# Altium project Triboelectric NEMS interface.PrjPcb
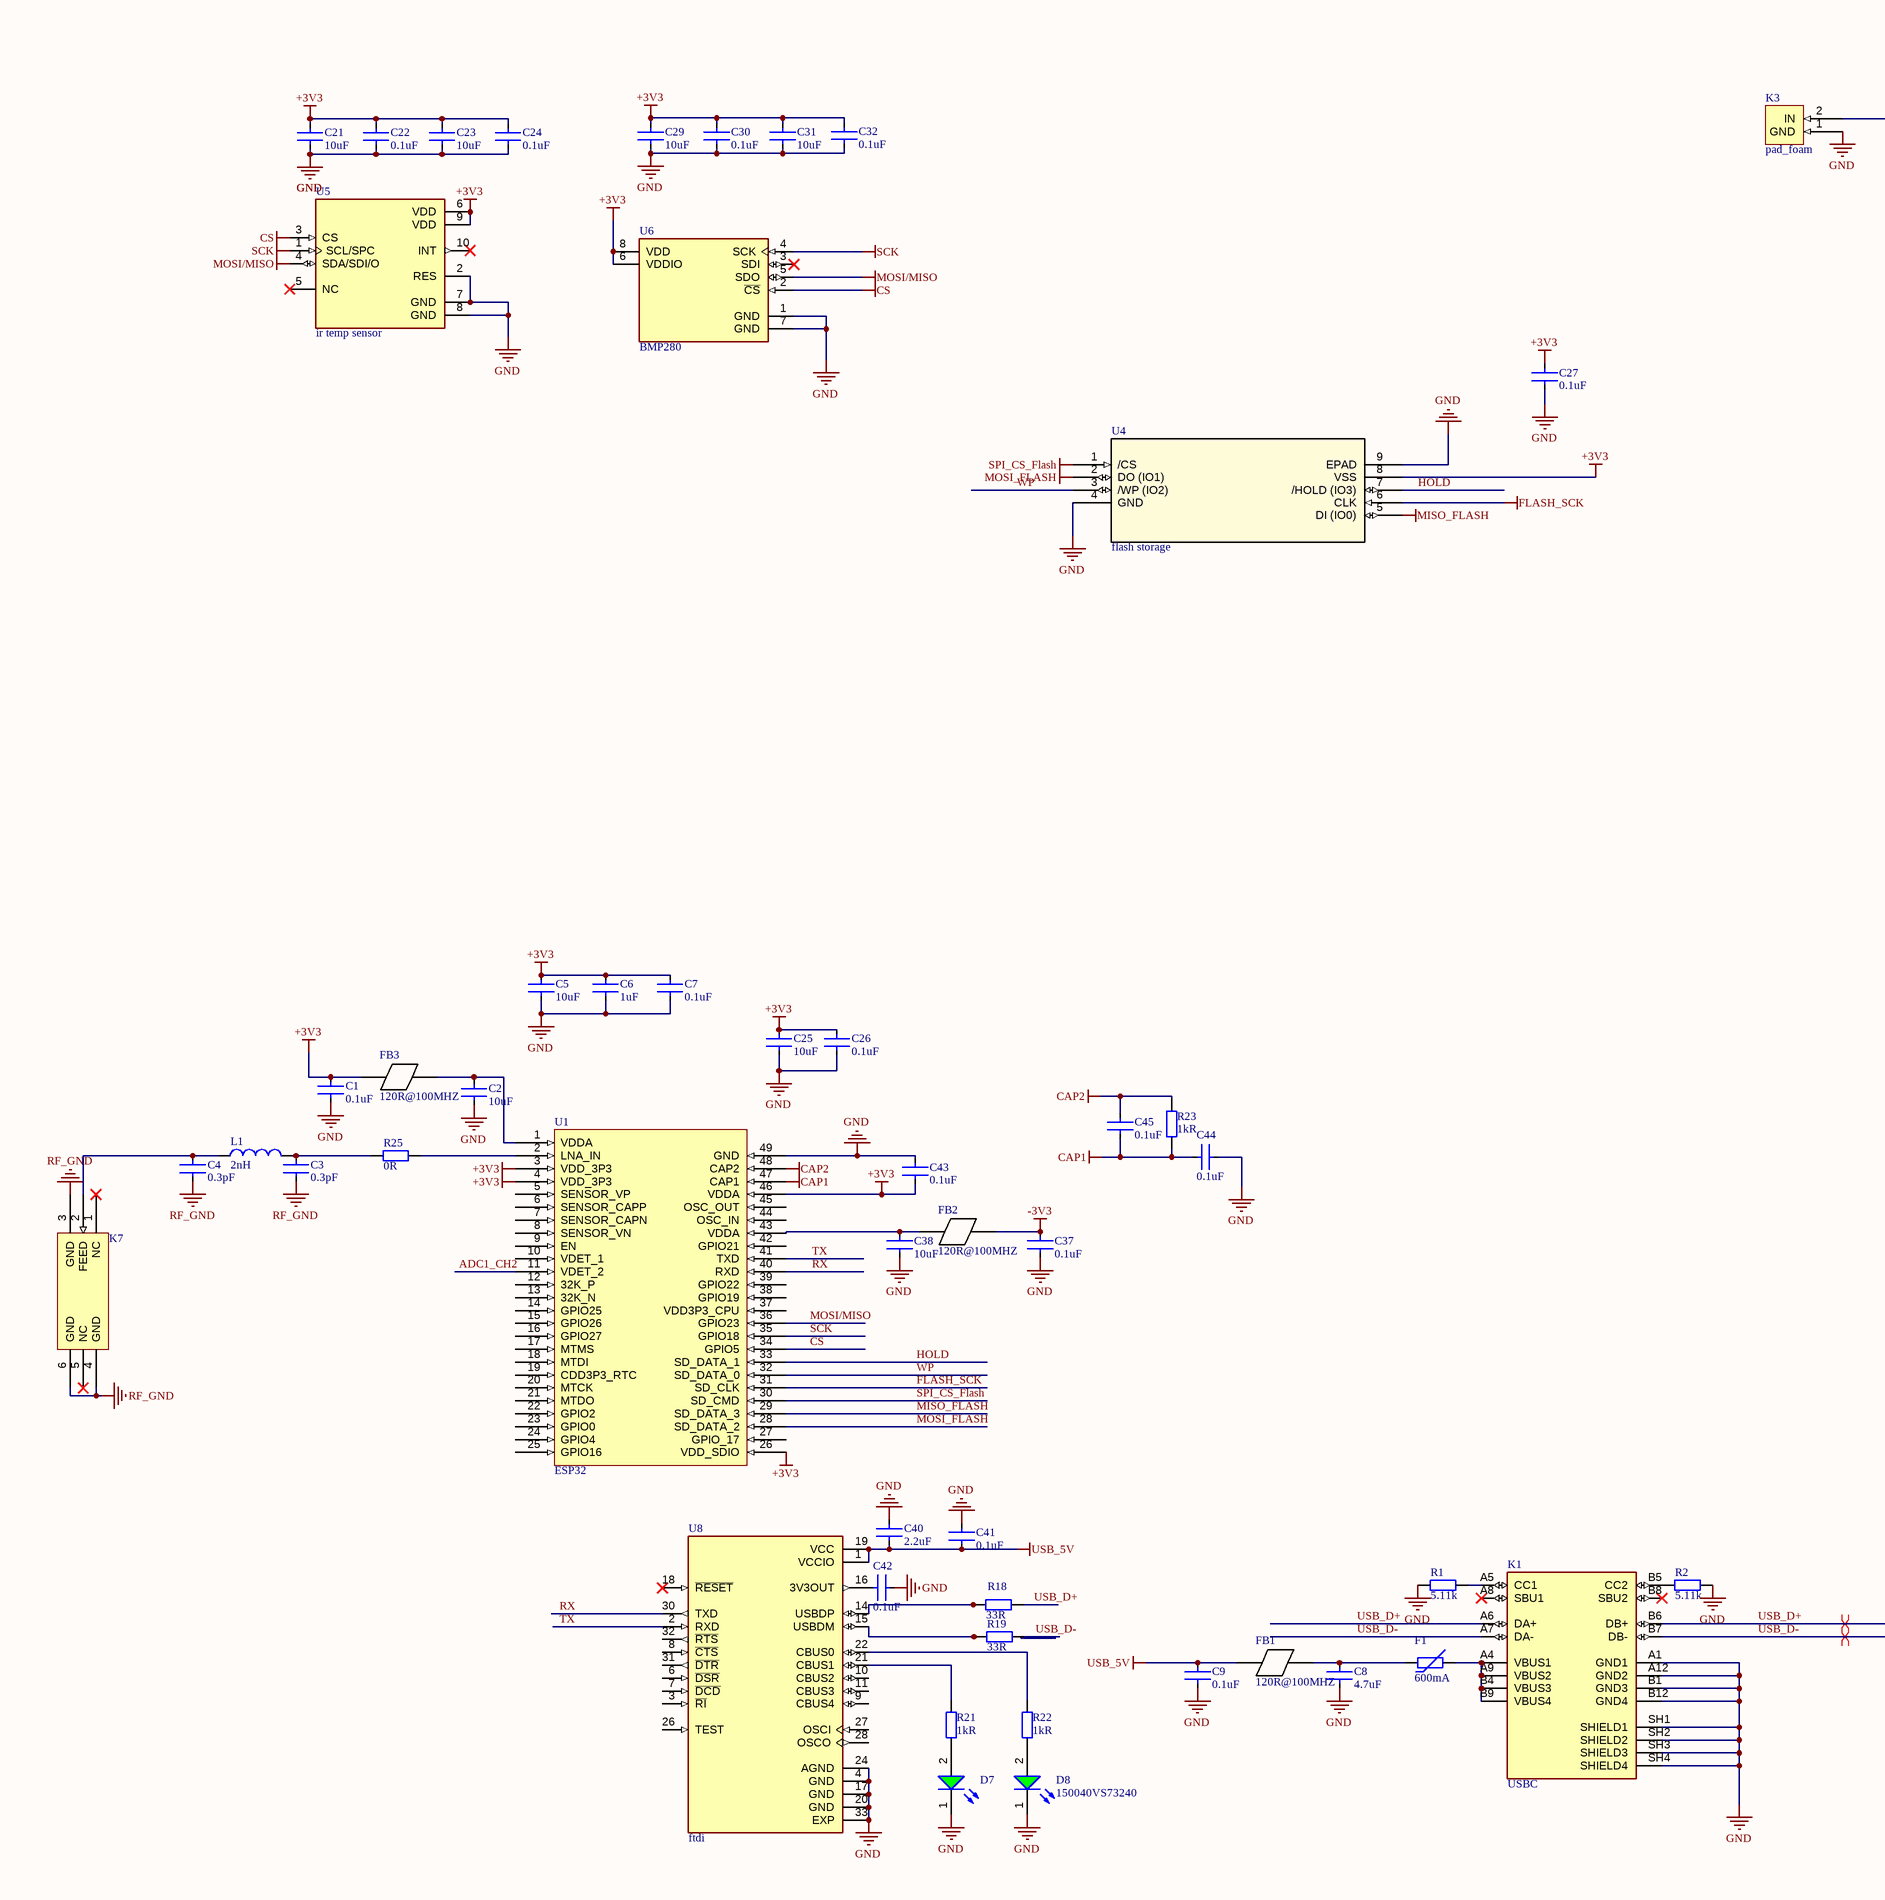
[diagram p0: Main Page.SchDoc, left]
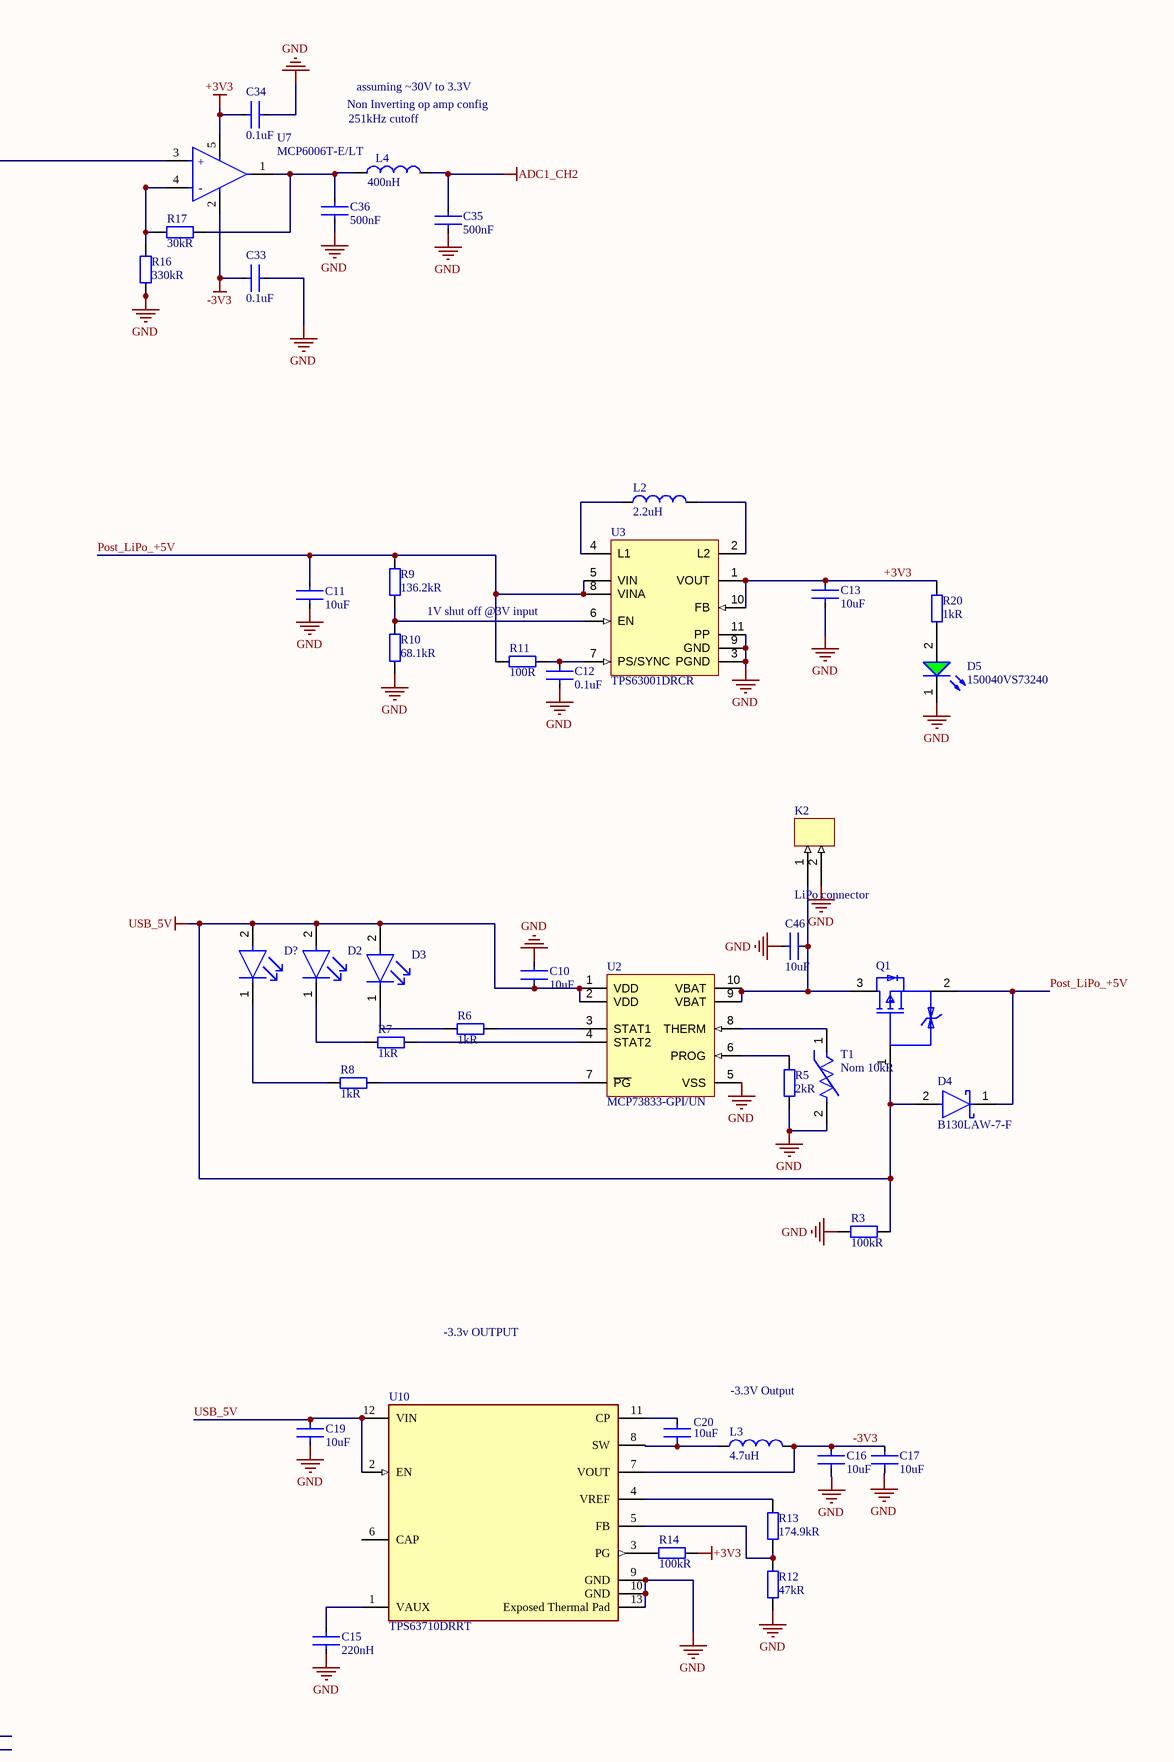
[diagram p1: Main Page.SchDoc, right]
1 sheet, 94 parts. Net scope: global (net labels, ports and power ports of the same name join across sheets).
Board file: Project_PCBPcbDoc.PcbDoc

## Sheet Main Page.SchDoc
size 594 x 420 mm; SheetNumber: 1; SheetTotal: 1

### Parts
C1  0.1uF  [0402 CAP]
C2  10uF  [0402 CAP]
C3  0.3pF  [0402 CAP]
C4  0.3pF  [0402 CAP]
C5  10uF  [0402 CAP]
C6  1uF  [0402 CAP]
C7  0.1uF  [0402 CAP]
C8  4.7uF  [0603 CAP]
C9  0.1uF  [0402 CAP]
C10  10uF  [0603 CAP]
C11  10uF  [0603 CAP]
C12  0.1uF  [0402 CAP]
C13  10uF  [0402 CAP]
C15  220nH  [0402 CAP]
C16  10uF  [0603 CAP]
C17  10uF  [0603 CAP]
C19  10uF  [0603 CAP]
C20  10uF  [0603 CAP]
C21  10uF  [0603 CAP]
C22  0.1uF  [0402 CAP]
C23  10uF  [0603 CAP]
C24  0.1uF  [0402 CAP]
C25  10uF  [0603 CAP]
C26  0.1uF  [0402 CAP]
C27  0.1uF  [0402 CAP]
C29  10uF  [0603 CAP]
C30  0.1uF  [0402 CAP]
C31  10uF  [0603 CAP]
C32  0.1uF  [0402 CAP]
C33  0.1uF  [0402 CAP]
C34  0.1uF  [0402 CAP]
C35  500nF  [0402 CAP]
C36  500nF  [0402 CAP]
C37  0.1uF  [0402 CAP]
C38  10uF  [0402 CAP]
C40  2.2uF  [0402 CAP]
C41  0.1uF  [0402 CAP]
C42  0.1uF  [0402 CAP]
C43  0.1uF  [0402 CAP]
C44  0.1uF  [0402 CAP]
C45  0.1uF  [0402 CAP]
C46  10uF  [0603 CAP]
D2  LTST-C190KGKT  [FP-LTST-C190KGKT-MFG]  (value not drawn)
D3  LTST-C190KGKT  [FP-LTST-C190KGKT-MFG]  (value not drawn)
D4  B130LAW-7-F  [FP-SOD123-MFG]
D5  150040VS73240  [WL-SMCC_0402_L1W0.5H0.4]
D7  150040VS73240  [WL-SMCC_0402_L1W0.5H0.4]  (value not drawn)
D8  150040VS73240  [WL-SMCC_0402_L1W0.5H0.4]
D?  LTST-C190KGKT  [FP-LTST-C190KGKT-MFG]  (value not drawn)
F1  600mA  [s]
FB1  120R@100MHZ  [0603 Inductor]
FB2  120R@100MHZ  [0603 Inductor]
FB3  120R@100MHZ  [0603 Inductor]
K1  USBC  [usbc]
K2  LiPo connector  [LiPo JST]
K3  pad_foam  [pad_elastomer]
K7  antenna  [BLE/WIFI antenna]  (value not drawn)
L1  2nH  [0603 Inductor]
L2  2.2uH  [power inductor]
L3  4.7uH  [power inductor]
L4  400nH  [0402 RES]
Q1  DMP1045U-7  [FP-SOT23-MFG]  (value not drawn)
R1  5.11k  [0402 RES]
R2  5.11k  [0402 RES]
R3  100kR  [0402 RES]
R5  2kR  [0402 RES]
R6  1kR  [0402 RES]
R7  1kR  [0402 RES]
R8  1kR  [0402 RES]
R9  136.2kR  [0402 RES]
R10  68.1kR  [0402 RES]
R11  100R  [0402 RES]
R12  47kR  [0402 RES]
R13  174.9kR  [0402 RES]
R14  100kR  [0402 RES]
R16  330kR  [0402 RES]
R17  30kR  [0402 RES]
R18  33R  [0402 RES]
R19  33R  [0402 RES]
R20  1kR  [0402 RES]
R21  1kR  [0402 RES]
R22  1kR  [0402 RES]
R23  1kR  [0402 RES]
R25  0R  [1206 RES]
T1  Nom 10kR  [FP-NTCG10-MFG]
U1  ESP32  [esp32]
U2  MCP73833-GPI/UN  [MSOP-UN10_N]
U3  TPS63001DRCR  [DRC0010J_V]
U4  flash storage  [flash storage]
U5  ir temp sensor  [IR temp sensor]
U6  BMP280  [FP-BMP280-MFG]
U7  MCP6006T-E/LT  [FP-C04-061-LT-IPC_C]
U8  ftdi  [ftdi]
U10  TPS63710DRRT  [FP-DRR0012C-MFG]

### Nets
+3V3: C1.2 C5.2 C6.2 C7.2 C13.2 C21.2 C22.2 C23.2 C24.2 C25.2 C26.2 C27.2 C29.2 C30.2 C31.2 C32.2 C34.2 C43.2 FB3.1 R14.2 R20.1 U1.3(VDD_3P3) U1.4(VDD_3P3) U1.26(VDD_SDIO) U1.46(VDDA) U3.1(VOUT) U3.10(FB) U4.8(VSS) U5.6(VDD) U5.9(VDD) U6.6(VDDIO) U6.8(VDD) U7.5(VDD)
-3V3: C16.2 C17.2 C33.1 C37.2 FB2.2 L3.2 U7.2(VSS) U10.7(VOUT)
ADC1_CH2: C35.2 L4.2 U1.11(VDET_2)
CAP1: C44.1 C45.2 R23.2 U1.47(CAP1)
CAP2: C45.1 R23.1 U1.48(CAP2)
CS: U1.34(GPIO5) U5.3(CS) U6.2(~{CS})
FLASH_SCK: U1.31(SD_CLK) U4.6(CLK)
GND: C1.1 C2.1 C5.1 C6.1 C7.1 C8.1 C9.1 C10.2 C11.1 C12.1 C13.1 C15.1 C16.1 C17.1 C19.2 C21.1 C22.1 C23.1 C24.1 C25.1 C26.1 C27.1 C29.1 C30.1 C31.1 C32.1 C33.2 C34.1 C35.1 C36.1 C37.1 C38.1 C40.1 C41.1 C42.1 C43.1 C44.2 C46.1 D5.1(K) D7.1(K) D8.1(K) K1.A1(GND1) K1.A12(GND2) K1.B1(GND3) K1.B12(GND4) K1.SH1(SHIELD1) K1.SH2(SHIELD2) K1.SH3(SHIELD3) K1.SH4(SHIELD4) K2.2 K3.1(GND) R1.2 R2.2 R3.1 R5.1 R10.1 R12.1 R16.1 T1.2 U1.49(GND) U2.5(VSS) U3.3(PGND) U3.9(GND) U3.11(PP) U4.4(GND) U4.9(EPAD) U5.2(RES) U5.7(GND) U5.8(GND) U6.1(GND) U6.7(GND) U8.4(GND) U8.17(GND) U8.20(GND) U8.24(AGND) U8.33(EXP) U10.9(GND) U10.10(GND) U10.13(Exposed_Thermal_Pad)
MISO_FLASH: U1.29(SD_DATA_3) U4.5(DI_(IO0))
MOSI/MISO: U1.36(GPIO23) U5.4(SDA/SDI/O) U6.5(SDO)
MOSI_FLASH: U1.28(SD_DATA_2) U4.2(DO_(IO1))
RF_GND: C3.1 C4.1 K7.3(GND) K7.4(GND) K7.6(GND)
SCK: U1.35(GPIO18) U5.1(SCL/SPC) U6.4(SCK)
SPI_CS_Flash: U1.30(SD_CMD) U4.1(/CS)
USB_5V: C9.2 C10.1 C19.1 C40.2 C41.2 D2.2(A) D3.2(A) D4.2(A) D?.2(A) FB1.1 Q1.1(G) R3.2 U2.1(VDD) U2.2(VDD) U8.1(VCCIO) U8.19(VCC) U10.2(EN) U10.12(VIN)
HOLD: U1.33(SD_DATA_1) U4.7(/HOLD_(IO3))
Post_LiPo_+5V: C11.2 D4.1(C) Q1.2(S) R9.2 R11.1 U3.5(VIN) U3.8(VINA)
RX: U1.40(RXD) U8.30(TXD)
TX: U1.41(TXD) U8.2(RXD)
USB_D+: K1.A6(DA+) K1.B6(DB+) R18.1
USB_D-: K1.A7(DA-) K1.B7(DB-) R19.1
WP: U1.32(SD_DATA_0) U4.3(/WP_(IO2))
NetC2_2: C2.2 FB3.2 U1.1(VDDA)
NetC3_2: C3.2 L1.2 R25.1
NetC4_2: C4.2 K7.2(FEED) L1.1
NetC8_2: C8.2 F1.1 FB1.2
NetC12_2: C12.2 R11.2 U3.7(PS/SYNC)
NetC15_2: C15.2 U10.1(VAUX)
NetC20_1: C20.1 L3.1 U10.8(SW)
NetC20_2: C20.2 U10.11(CP)
NetC36_2: C36.2 L4.1 R17.2 U7.1(VOUT)
NetC38_2: C38.2 FB2.1 U1.43(VDDA)
NetC42_2: C42.2 U8.16(3V3OUT)
NetC46_2: C46.2 K2.1 Q1.3(D) U2.9(VBAT) U2.10(VBAT)
NetD2_1: D2.1(C) R7.1
NetD3_1: D3.1(C) R6.1
NetD5_2: D5.2(A) R20.2
NetD7_2: D7.2(A) R21.2
NetD8_2: D8.2(A) R22.2
NetD?_1: D?.1(C) R8.1
NetF1_2: F1.2 K1.A4(VBUS1) K1.A9(VBUS2) K1.B4(VBUS3) K1.B9(VBUS4)
NetK1_A5: K1.A5(CC1) R1.1
NetK1_B5: K1.B5(CC2) R2.1
NetK3_2: K3.2(IN) U7.3(VIN+)
NetL2_1: L2.1 U3.4(L1)
NetL2_2: L2.2 U3.2(L2)
NetR5_2: R5.2 U2.6(PROG)
NetR6_2: R6.2 U2.3(STAT1)
NetR7_2: R7.2 U2.4(STAT2)
NetR8_2: R8.2 U2.7(~{PG})
NetR9_1: R9.1 R10.2 U3.6(EN)
NetR12_2: R12.2 R13.1 U10.5(FB)
NetR13_2: R13.2 U10.4(VREF)
NetR14_1: R14.1 U10.3(PG)
NetR16_2: R16.2 R17.1 U7.4(VIN-)
NetR18_2: R18.2 U8.14(USBDP)
NetR19_2: R19.2 U8.15(USBDM)
NetR21_1: R21.1 U8.21(CBUS1)
NetR22_1: R22.1 U8.22(CBUS0)
NetR25_2: R25.2 U1.2(LNA_IN)
NetT1_1: T1.1 U2.8(THERM)

Not connected (* = marked no-connect by the designer): K1 A8(SBU1)* B8(SBU2)*; K7 1(NC)* 5(NC)*; U1 5(SENSOR_VP) 6(SENSOR_CAPP) 7(SENSOR_CAPN) 8(SENSOR_VN) 9(EN) 10(VDET_1) 12(32K_P) 13(32K_N) 14(GPIO25) 15(GPIO26) 16(GPIO27) 17(MTMS) 18(MTDI) 19(CDD3P3_RTC) 20(MTCK) 21(MTDO) 22(GPIO2) 23(GPIO0) 24(GPIO4) 25(GPIO16) 27(GPIO_17) 37(VDD3P3_CPU) 38(GPIO19) 39(GPIO22) 42(GPIO21) 44(OSC_IN) 45(OSC_OUT); U5 5(NC)* 10(INT)*; U6 3(SDI)*; U8 3(~{RI}) 6(~{DSR}) 7(~{DCD}) 8(~{CTS}) 9(CBUS4) 10(CBUS2) 11(CBUS3) 18(~{RESET})* 26(TEST) 27(OSCI) 28(OSCO) 31(~{DTR}) 32(~{RTS}); U10 6(CAP)

### Layout directives
differential pair: USB_D+, USB_D-

### Notes on the sheet
- Non Inverting op amp config
- (near L4) 251kHz cutoff
- assuming ~30V to 3.3V
- 1V shut off @3V input
- -3.3v OUTPUT
- -3.3V Output
- DWG NO:
- REV:
- THIS DOCUMENT AND THE DATA DISCLOSED HEREIN OR
- HEREWITH IS THE PROPERTY OF ALTIUM LIMITED AND MAY
- BE FREELY DISTRIBUTED IN WHOLE. NO RIGHTS ARE
- RESERVED OR EXPRESS OR IMPLIED WARANTEE GIVEN.
- REVISION
- DESCRIPTION
- DATE
- APPROVED
- ENG:
- APPROVALS
- PROJECT
- DSN:
- CHK:
- REFERENCE DOCUMENTS
- PROJECT REVISION:
- TITLE
- DOCUMENT REVISION:
- DESIGN ITEM:
- BOM:
- FAB DWG:
- PCB DWG:
- ASSY DWG:
- SCALE:
- A2
- SIZE
- CAGE CODE
- FILE NAME
- DWG NO.
- SHEET
- OF
- REV
- (in symbol CMP-06302-000287-1) +; -

### Library data of the parts
C1-C13 C15-C17 C19-C27 C29-C38 C40-C46 = capacitor
  C5: Parameter 1: *
D2 D3 D? = CMP-2000-05197-2: LED GREEN CLEAR CHIP SMD; Test Current: 20mA; Power Rating: 75mW; Forward Voltage: 2V; Wavelength: 574nm; Number of LEDs: 1; Reverse Voltage: 5V; Dominant Wavelength: 571nm; Lens Style: Diffused; Luminous Intensity: 35mcd; Forward Current: 30mA; Viewing Angle: 130°; Lens Color: Colorless; Width: 0.8mm; Case Code (Imperial): 0603; Case Code (Metric): 1608; Number of Pins: 2; Radiation Hardening: No; Package Quantity: 1; Lead Free: Lead Free; Lens Transparency: Clear; Depth: 0.8mm; Power Dissipation: 75mW; Mount: Surface Mount; Max Operating Temperature: 85°C; Case/Package: 0603; Height: 0.8mm; Illumination Color: Green; Color: Green; Length: 1.6mm; Packaging: Tape and Reel; Number of Elements: 1; Min Operating Temperature: -55°C
D4 = CMP-2000-05884-2: DIODE SCHOTTKY 30V 1A SOD123; Manufacturer: Diodes Inc.; Max Junction Temp: +125°C; Value: 40pF; Standoff Height: 0mm; Max Surge Forward Current: 12A; Peak Reverse Current: 0.15mA; Ipc Land Pattern Name: SOD365155X110-2; Octopart: https://octopart.com/b130law-7-f-diodes+inc.-325739; ComponentLink2URL: https://www.diodes.com/assets/Datasheets/ds30308.pdf; Reverse Voltage: 30V; Forward Current: 1A; Digikey Description: DIODE SCHOTTKY 30V 1A SOD123; Temperature Range High: +125°C; Capacitance: 40pF; Device Class L3: Schottky Diodes; Device Class L1: Discrete Semiconductors; Max Repetitive Reverse Voltage: 30V; ComponentLink2Description: Datasheet; RoHS: TRUE; Temperature: -55°C to +125°C; Temperature Range Low: -55°C; Manufacturer Part Number: B130LAW-7-F; Footprint Url: https://www.diodes.com/assets/Package-Files/SOD123.pdf; Mouser Description: Schottky Diodes & Rectifiers 30V 1A; Automotive: No; Package: SOD123; Lead Free: Yes; Height: 1.45mm; Device Class L2: Diodes; Category: Diode
D5 D7 D8 = CMP-03913-90235559-1: 150040VS73240 WL-SMCC SMT Mono-Color Chip LED Compact; Color: Green; Viewing Angle: 120°; Forward Current: 60mA; Max Junction Temperature (Tj): 95°C; Reverse Voltage: 5V; Power Dissipation: 75mW; Wavelength: 570nm; Forward Voltage: 2V; Luminous Intensity: 50mcd; Peak Wavelength: 572nm; RoHS: Compliant; Height: 400µm; Width: 500µm; Case/Package: 0402; Min Operating Temperature: -40°C; Packaging: Tape and Reel; Length: 1mm; NexarPartId: 90235559; Dominant Wavelength: 570nm; Max Reverse Voltage (DC): 5V; Max Operating Temperature: 85°C
F1 = polyfuse
FB1-FB3 = Ferrite Bead
L1 L4 = inductor 0603
L2 L3 = power inductor
Q1 = CMP-12801-000025-1: MOSFET P-CH 12V 4A SOT23; Manufacturer: Diodes Inc.; Drain To Source Voltage: -12V; Standoff Height: 0.013mm; Max Junction Temp: +150°C; Gate To Source Voltage: 8V; Number Of Channels: 1; Drain To Source Resistance: 26mΩ; Gate Charge At Vgs: 15.8nC @ -4.5V; Power Dissipation: 0.8W; Automotive Grade: NA; Pulse Drain Current: 40A; Turn Off Delay Time: 91.2ns; Depletion Mode: False; Threshold Vgs Min: -0.3V; Input Capacitace At Vds: 1357pF @ -10V; Threshold Vgs Max: -1V; Typ Forward Diode Voltage: -0.6V; Turn On Delay Time: 15.7ns; Rthja Max: 168°C/W; Category: Trans; RoHS: TRUE; Manufacturer Part Number: DMP1045U-7; Automotive: No; Continuous Drain Current: 4A; Package: SOT23; ComponentLink2Description: Datasheet; Lead Free: Yes; Device Class L3: MOSFETs; Device Class L2: Transistors; Digikey Description: MOSFET P-CH 12V 4A SOT23; Drain To Source Breakdown Voltage: -12V; Device Class L1: Discrete Semiconductors; Height: 1.1mm; Temperature Range Low: -55°C; Mouser Description: P-Channel 12 V 31 mOhm Surface Mount Enhancement Mode Mosfet - SOT-23-3; Temperature: -55°C to +150°C; Octopart: https://octopart.com/dmp1045u-7-diodes+inc.-20474459; Ipc Land Pattern Name: SOT92P240X102-3; ComponentLink2URL: https://www.diodes.com/assets/Datasheets/DMP1045U.pdf; Number Of P Channels: 1; Footprint Url: https://www.diodes.com/assets/Package-Files/SOT23.pdf; Temperature Range High: +150°C
R1-R3 R5-R14 R16-R23 = Resistor
R25 = 0603 RES
T1 = CMP-08233-000003-1: THERMISTOR NTC 10KOHM 3380K 0402; Tolerance: 1%; Packaging: Tape and Reel; Number of Pins: 2; Min Operating Temperature: -40°C; Case/Package: 0402; Mount: Surface Mount; Case Code (Metric): 1005; Max Operating Temperature: 125°C; Case Code (Imperial): 0402
U2 = CMP-0133-00193-1: Stand-Alone Linear Li-Ion/Li-Polymer Charge Management Controller with Power-Good Output, 4.2V, 10-Pin MSOP, Industrial Temperature; PackageReference: MSOP-UN10; PackageDescription: 10-Lead Plastic Micro Small Outline Package (UN) [MSOP]; DatasheetVersion: revB, May-2009; PackageVersion: revBB, Aug-2009
U3 = CMP-0345-00006-2: Buck-Boost Voltage Converter with 1.8 to 5.5 V Input and 3.3 V Output, -40 to 85 degC, 10-Pin SON (DRC), Green (RoHS & no Sb/Br); Manufacturer: Texas Instruments; Synchronous Rectification: TRUE; Iq(Typ)(mA): 0.03; Regulated Outputs(#): 1; Preset Vout(V): 3.3; Vin(Min)(V): 1.8; Switching Frequency(Max)(kHz): 1500; Iout(Max)(A): 1.2; SubFamily: Buck-Boost Regulator; Vin(Max)(V): 5.5; PartNumber: TPS63001DRCR; Topology: Buck-Boost; Dynamic Voltage Scaling: TRUE; PackageVersion: revL, Sep-2011; ComponentLink2Description: Package Specification; DatasheetVersion: SLVS520B; Eco-Plan: Green (RoHS & no Sb/Br); ComponentLink1URL: http://www.ti.com/general/docs/lit/getliterature.tsp?genericPartNumber=TPS63001&fileType=pdf; Mounting Technology: Surface Mount; Vout(Min)(V): 3.3; ComponentLink2URL: http://www.ti.com/litv/pdf/mpds117k; PackageDescription: 10-Pin Plastic Small Outline No-Lead, 3 x 3 x 1 mm Body, 0.5 mm Pitch, Exposed Pad; PackageReference: DRC0010J; Vout(Max)(V): 3.3; ComponentLink1Description: Datasheet
U6 = CMP-2000-05076-3: SENSOR PRESSURE ABS; Operating Pressure: 15.95PSI; Pressure Type: Absolute; Output Type: SPI; Max Pressure: 290.08PSI; Port Style: No Port; Case/Package: SMD/SMT; Lead Free: Lead Free; Termination: SMD/SMT; Min Operating Temperature: -40°C; Number of Pins: 8; Max Operating Temperature: 85°C
U7 = CMP-06302-000287-1: IC OPAMP GP 1 CIRCUIT SC70-5; RoHS Compliant: Yes
U10 = CMP-04918-000368-1: IC REG BUCK ADJUSTABLE 1A 12SON; Synchronous Rectifier: Yes; Number of Outputs: 1; Output Configuration: Negative; Min Input Voltage: 3.1V; Max Input Voltage: 14V; Max Output Voltage: -5.5V; Switching Frequency: 1.5MHz; Min Output Voltage: -1V; Mount: Surface Mount; Packaging: Tape and Reel; RoHS Compliant: Yes; Output Type: Adjustable; Output Current: 1A; Min Operating Temperature: -40°C; Max Operating Temperature: 125°C